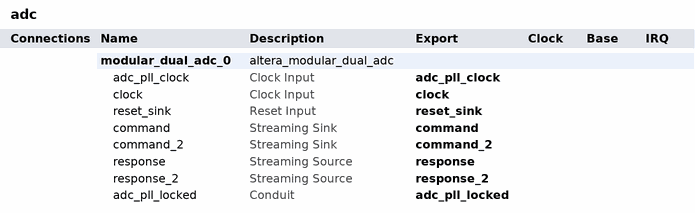
[diagram p0: system contents]
# Platform Designer (Qsys) system adc, MAX 10 10M50DAF484C7G
# Parameters at their usual value, and those the tool derives, are not listed.
package require -exact qsys 17.1
create_system adc
set_project_property DEVICE_FAMILY {MAX 10}
set_project_property DEVICE 10M50DAF484C7G

add_instance modular_dual_adc_0 altera_modular_dual_adc 17.1
set_instance_property modular_dual_adc_0 AUTO_EXPORT true
set_instance_parameter_value modular_dual_adc_0 CLOCK_FREQ 0
set_instance_parameter_value modular_dual_adc_0 CORE_VAR 3
set_instance_parameter_value modular_dual_adc_0 DEVICE_PART 10M50DAF484C7G
set_instance_parameter_value modular_dual_adc_0 ENABLE_DEBUG 0
set_instance_parameter_value modular_dual_adc_0 FAMILY {MAX 10}
set_instance_parameter_value modular_dual_adc_0 MONITOR_COUNT_WIDTH 12
set_instance_parameter_value modular_dual_adc_0 clkdiv 2
set_instance_parameter_value modular_dual_adc_0 en_thmax_ch0 false
set_instance_parameter_value modular_dual_adc_0 en_thmax_ch1 false
set_instance_parameter_value modular_dual_adc_0 en_thmax_ch10 false
set_instance_parameter_value modular_dual_adc_0 en_thmax_ch11 false
set_instance_parameter_value modular_dual_adc_0 en_thmax_ch12 false
set_instance_parameter_value modular_dual_adc_0 en_thmax_ch13 false
set_instance_parameter_value modular_dual_adc_0 en_thmax_ch14 false
set_instance_parameter_value modular_dual_adc_0 en_thmax_ch15 false
set_instance_parameter_value modular_dual_adc_0 en_thmax_ch16 false
set_instance_parameter_value modular_dual_adc_0 en_thmax_ch17 false
set_instance_parameter_value modular_dual_adc_0 en_thmax_ch2 false
set_instance_parameter_value modular_dual_adc_0 en_thmax_ch3 false
set_instance_parameter_value modular_dual_adc_0 en_thmax_ch4 false
set_instance_parameter_value modular_dual_adc_0 en_thmax_ch5 false
set_instance_parameter_value modular_dual_adc_0 en_thmax_ch6 false
set_instance_parameter_value modular_dual_adc_0 en_thmax_ch7 false
set_instance_parameter_value modular_dual_adc_0 en_thmax_ch8 false
set_instance_parameter_value modular_dual_adc_0 en_thmax_ch9 false
set_instance_parameter_value modular_dual_adc_0 en_thmin_ch0 false
set_instance_parameter_value modular_dual_adc_0 en_thmin_ch1 false
set_instance_parameter_value modular_dual_adc_0 en_thmin_ch10 false
set_instance_parameter_value modular_dual_adc_0 en_thmin_ch11 false
set_instance_parameter_value modular_dual_adc_0 en_thmin_ch12 false
set_instance_parameter_value modular_dual_adc_0 en_thmin_ch13 false
set_instance_parameter_value modular_dual_adc_0 en_thmin_ch14 false
set_instance_parameter_value modular_dual_adc_0 en_thmin_ch15 false
set_instance_parameter_value modular_dual_adc_0 en_thmin_ch16 false
set_instance_parameter_value modular_dual_adc_0 en_thmin_ch17 false
set_instance_parameter_value modular_dual_adc_0 en_thmin_ch2 false
set_instance_parameter_value modular_dual_adc_0 en_thmin_ch3 false
set_instance_parameter_value modular_dual_adc_0 en_thmin_ch4 false
set_instance_parameter_value modular_dual_adc_0 en_thmin_ch5 false
set_instance_parameter_value modular_dual_adc_0 en_thmin_ch6 false
set_instance_parameter_value modular_dual_adc_0 en_thmin_ch7 false
set_instance_parameter_value modular_dual_adc_0 en_thmin_ch8 false
set_instance_parameter_value modular_dual_adc_0 en_thmin_ch9 false
set_instance_parameter_value modular_dual_adc_0 en_tsd_max false
set_instance_parameter_value modular_dual_adc_0 en_tsd_min false
set_instance_parameter_value modular_dual_adc_0 enable_usr_sim 0
set_instance_parameter_value modular_dual_adc_0 external_vref 2.5
set_instance_parameter_value modular_dual_adc_0 external_vref_adc2 2.5
set_instance_parameter_value modular_dual_adc_0 int_vref_vr 3.0
set_instance_parameter_value modular_dual_adc_0 int_vref_vr_adc2 3.0
set_instance_parameter_value modular_dual_adc_0 prescaler_ch17 false
set_instance_parameter_value modular_dual_adc_0 prescaler_ch8 false
set_instance_parameter_value modular_dual_adc_0 refsel 0
set_instance_parameter_value modular_dual_adc_0 refsel_adc2 0
set_instance_parameter_value modular_dual_adc_0 sample_rate 0
set_instance_parameter_value modular_dual_adc_0 seq_order_length 1
set_instance_parameter_value modular_dual_adc_0 seq_order_slot_1 30
set_instance_parameter_value modular_dual_adc_0 seq_order_slot_10 30
set_instance_parameter_value modular_dual_adc_0 seq_order_slot_10_adc2 30
set_instance_parameter_value modular_dual_adc_0 seq_order_slot_11 30
set_instance_parameter_value modular_dual_adc_0 seq_order_slot_11_adc2 30
set_instance_parameter_value modular_dual_adc_0 seq_order_slot_12 30
set_instance_parameter_value modular_dual_adc_0 seq_order_slot_12_adc2 30
set_instance_parameter_value modular_dual_adc_0 seq_order_slot_13 30
set_instance_parameter_value modular_dual_adc_0 seq_order_slot_13_adc2 30
set_instance_parameter_value modular_dual_adc_0 seq_order_slot_14 30
set_instance_parameter_value modular_dual_adc_0 seq_order_slot_14_adc2 30
set_instance_parameter_value modular_dual_adc_0 seq_order_slot_15 30
set_instance_parameter_value modular_dual_adc_0 seq_order_slot_15_adc2 30
set_instance_parameter_value modular_dual_adc_0 seq_order_slot_16 30
set_instance_parameter_value modular_dual_adc_0 seq_order_slot_16_adc2 30
set_instance_parameter_value modular_dual_adc_0 seq_order_slot_17 30
set_instance_parameter_value modular_dual_adc_0 seq_order_slot_17_adc2 30
set_instance_parameter_value modular_dual_adc_0 seq_order_slot_18 30
set_instance_parameter_value modular_dual_adc_0 seq_order_slot_18_adc2 30
set_instance_parameter_value modular_dual_adc_0 seq_order_slot_19 30
set_instance_parameter_value modular_dual_adc_0 seq_order_slot_19_adc2 30
set_instance_parameter_value modular_dual_adc_0 seq_order_slot_1_adc2 30
set_instance_parameter_value modular_dual_adc_0 seq_order_slot_2 30
set_instance_parameter_value modular_dual_adc_0 seq_order_slot_20 30
set_instance_parameter_value modular_dual_adc_0 seq_order_slot_20_adc2 30
set_instance_parameter_value modular_dual_adc_0 seq_order_slot_21 30
set_instance_parameter_value modular_dual_adc_0 seq_order_slot_21_adc2 30
set_instance_parameter_value modular_dual_adc_0 seq_order_slot_22 30
set_instance_parameter_value modular_dual_adc_0 seq_order_slot_22_adc2 30
set_instance_parameter_value modular_dual_adc_0 seq_order_slot_23 30
set_instance_parameter_value modular_dual_adc_0 seq_order_slot_23_adc2 30
set_instance_parameter_value modular_dual_adc_0 seq_order_slot_24 30
set_instance_parameter_value modular_dual_adc_0 seq_order_slot_24_adc2 30
set_instance_parameter_value modular_dual_adc_0 seq_order_slot_25 30
set_instance_parameter_value modular_dual_adc_0 seq_order_slot_25_adc2 30
set_instance_parameter_value modular_dual_adc_0 seq_order_slot_26 30
set_instance_parameter_value modular_dual_adc_0 seq_order_slot_26_adc2 30
set_instance_parameter_value modular_dual_adc_0 seq_order_slot_27 30
set_instance_parameter_value modular_dual_adc_0 seq_order_slot_27_adc2 30
set_instance_parameter_value modular_dual_adc_0 seq_order_slot_28 30
set_instance_parameter_value modular_dual_adc_0 seq_order_slot_28_adc2 30
set_instance_parameter_value modular_dual_adc_0 seq_order_slot_29 30
set_instance_parameter_value modular_dual_adc_0 seq_order_slot_29_adc2 30
set_instance_parameter_value modular_dual_adc_0 seq_order_slot_2_adc2 30
set_instance_parameter_value modular_dual_adc_0 seq_order_slot_3 30
set_instance_parameter_value modular_dual_adc_0 seq_order_slot_30 30
set_instance_parameter_value modular_dual_adc_0 seq_order_slot_30_adc2 30
set_instance_parameter_value modular_dual_adc_0 seq_order_slot_31 30
set_instance_parameter_value modular_dual_adc_0 seq_order_slot_31_adc2 30
set_instance_parameter_value modular_dual_adc_0 seq_order_slot_32 30
set_instance_parameter_value modular_dual_adc_0 seq_order_slot_32_adc2 30
set_instance_parameter_value modular_dual_adc_0 seq_order_slot_33 30
set_instance_parameter_value modular_dual_adc_0 seq_order_slot_33_adc2 30
set_instance_parameter_value modular_dual_adc_0 seq_order_slot_34 30
set_instance_parameter_value modular_dual_adc_0 seq_order_slot_34_adc2 30
set_instance_parameter_value modular_dual_adc_0 seq_order_slot_35 30
set_instance_parameter_value modular_dual_adc_0 seq_order_slot_35_adc2 30
set_instance_parameter_value modular_dual_adc_0 seq_order_slot_36 30
set_instance_parameter_value modular_dual_adc_0 seq_order_slot_36_adc2 30
set_instance_parameter_value modular_dual_adc_0 seq_order_slot_37 30
set_instance_parameter_value modular_dual_adc_0 seq_order_slot_37_adc2 30
set_instance_parameter_value modular_dual_adc_0 seq_order_slot_38 30
set_instance_parameter_value modular_dual_adc_0 seq_order_slot_38_adc2 30
set_instance_parameter_value modular_dual_adc_0 seq_order_slot_39 30
set_instance_parameter_value modular_dual_adc_0 seq_order_slot_39_adc2 30
set_instance_parameter_value modular_dual_adc_0 seq_order_slot_3_adc2 30
set_instance_parameter_value modular_dual_adc_0 seq_order_slot_4 30
set_instance_parameter_value modular_dual_adc_0 seq_order_slot_40 30
set_instance_parameter_value modular_dual_adc_0 seq_order_slot_40_adc2 30
set_instance_parameter_value modular_dual_adc_0 seq_order_slot_41 30
set_instance_parameter_value modular_dual_adc_0 seq_order_slot_41_adc2 30
set_instance_parameter_value modular_dual_adc_0 seq_order_slot_42 30
set_instance_parameter_value modular_dual_adc_0 seq_order_slot_42_adc2 30
set_instance_parameter_value modular_dual_adc_0 seq_order_slot_43 30
set_instance_parameter_value modular_dual_adc_0 seq_order_slot_43_adc2 30
set_instance_parameter_value modular_dual_adc_0 seq_order_slot_44 30
set_instance_parameter_value modular_dual_adc_0 seq_order_slot_44_adc2 30
set_instance_parameter_value modular_dual_adc_0 seq_order_slot_45 30
set_instance_parameter_value modular_dual_adc_0 seq_order_slot_45_adc2 30
set_instance_parameter_value modular_dual_adc_0 seq_order_slot_46 30
set_instance_parameter_value modular_dual_adc_0 seq_order_slot_46_adc2 30
set_instance_parameter_value modular_dual_adc_0 seq_order_slot_47 30
set_instance_parameter_value modular_dual_adc_0 seq_order_slot_47_adc2 30
set_instance_parameter_value modular_dual_adc_0 seq_order_slot_48 30
set_instance_parameter_value modular_dual_adc_0 seq_order_slot_48_adc2 30
set_instance_parameter_value modular_dual_adc_0 seq_order_slot_49 30
set_instance_parameter_value modular_dual_adc_0 seq_order_slot_49_adc2 30
set_instance_parameter_value modular_dual_adc_0 seq_order_slot_4_adc2 30
set_instance_parameter_value modular_dual_adc_0 seq_order_slot_5 30
set_instance_parameter_value modular_dual_adc_0 seq_order_slot_50 30
set_instance_parameter_value modular_dual_adc_0 seq_order_slot_50_adc2 30
set_instance_parameter_value modular_dual_adc_0 seq_order_slot_51 30
set_instance_parameter_value modular_dual_adc_0 seq_order_slot_51_adc2 30
set_instance_parameter_value modular_dual_adc_0 seq_order_slot_52 30
set_instance_parameter_value modular_dual_adc_0 seq_order_slot_52_adc2 30
set_instance_parameter_value modular_dual_adc_0 seq_order_slot_53 30
set_instance_parameter_value modular_dual_adc_0 seq_order_slot_53_adc2 30
set_instance_parameter_value modular_dual_adc_0 seq_order_slot_54 30
set_instance_parameter_value modular_dual_adc_0 seq_order_slot_54_adc2 30
set_instance_parameter_value modular_dual_adc_0 seq_order_slot_55 30
set_instance_parameter_value modular_dual_adc_0 seq_order_slot_55_adc2 30
set_instance_parameter_value modular_dual_adc_0 seq_order_slot_56 30
set_instance_parameter_value modular_dual_adc_0 seq_order_slot_56_adc2 30
set_instance_parameter_value modular_dual_adc_0 seq_order_slot_57 30
set_instance_parameter_value modular_dual_adc_0 seq_order_slot_57_adc2 30
set_instance_parameter_value modular_dual_adc_0 seq_order_slot_58 30
set_instance_parameter_value modular_dual_adc_0 seq_order_slot_58_adc2 30
set_instance_parameter_value modular_dual_adc_0 seq_order_slot_59 30
set_instance_parameter_value modular_dual_adc_0 seq_order_slot_59_adc2 30
set_instance_parameter_value modular_dual_adc_0 seq_order_slot_5_adc2 30
set_instance_parameter_value modular_dual_adc_0 seq_order_slot_6 30
set_instance_parameter_value modular_dual_adc_0 seq_order_slot_60 30
set_instance_parameter_value modular_dual_adc_0 seq_order_slot_60_adc2 30
set_instance_parameter_value modular_dual_adc_0 seq_order_slot_61 30
set_instance_parameter_value modular_dual_adc_0 seq_order_slot_61_adc2 30
set_instance_parameter_value modular_dual_adc_0 seq_order_slot_62 30
set_instance_parameter_value modular_dual_adc_0 seq_order_slot_62_adc2 30
set_instance_parameter_value modular_dual_adc_0 seq_order_slot_63 30
set_instance_parameter_value modular_dual_adc_0 seq_order_slot_63_adc2 30
set_instance_parameter_value modular_dual_adc_0 seq_order_slot_64 30
set_instance_parameter_value modular_dual_adc_0 seq_order_slot_64_adc2 30
set_instance_parameter_value modular_dual_adc_0 seq_order_slot_6_adc2 30
set_instance_parameter_value modular_dual_adc_0 seq_order_slot_7 30
set_instance_parameter_value modular_dual_adc_0 seq_order_slot_7_adc2 30
set_instance_parameter_value modular_dual_adc_0 seq_order_slot_8 30
set_instance_parameter_value modular_dual_adc_0 seq_order_slot_8_adc2 30
set_instance_parameter_value modular_dual_adc_0 seq_order_slot_9 30
set_instance_parameter_value modular_dual_adc_0 seq_order_slot_9_adc2 30
set_instance_parameter_value modular_dual_adc_0 thmax_ch0 0.0
set_instance_parameter_value modular_dual_adc_0 thmax_ch1 0.0
set_instance_parameter_value modular_dual_adc_0 thmax_ch10 0.0
set_instance_parameter_value modular_dual_adc_0 thmax_ch11 0.0
set_instance_parameter_value modular_dual_adc_0 thmax_ch12 0.0
set_instance_parameter_value modular_dual_adc_0 thmax_ch13 0.0
set_instance_parameter_value modular_dual_adc_0 thmax_ch14 0.0
set_instance_parameter_value modular_dual_adc_0 thmax_ch15 0.0
set_instance_parameter_value modular_dual_adc_0 thmax_ch16 0.0
set_instance_parameter_value modular_dual_adc_0 thmax_ch17 0.0
set_instance_parameter_value modular_dual_adc_0 thmax_ch2 0.0
set_instance_parameter_value modular_dual_adc_0 thmax_ch3 0.0
set_instance_parameter_value modular_dual_adc_0 thmax_ch4 0.0
set_instance_parameter_value modular_dual_adc_0 thmax_ch5 0.0
set_instance_parameter_value modular_dual_adc_0 thmax_ch6 0.0
set_instance_parameter_value modular_dual_adc_0 thmax_ch7 0.0
set_instance_parameter_value modular_dual_adc_0 thmax_ch8 0.0
set_instance_parameter_value modular_dual_adc_0 thmax_ch9 0.0
set_instance_parameter_value modular_dual_adc_0 thmin_ch0 0.0
set_instance_parameter_value modular_dual_adc_0 thmin_ch1 0.0
set_instance_parameter_value modular_dual_adc_0 thmin_ch10 0.0
set_instance_parameter_value modular_dual_adc_0 thmin_ch11 0.0
set_instance_parameter_value modular_dual_adc_0 thmin_ch12 0.0
set_instance_parameter_value modular_dual_adc_0 thmin_ch13 0.0
set_instance_parameter_value modular_dual_adc_0 thmin_ch14 0.0
set_instance_parameter_value modular_dual_adc_0 thmin_ch15 0.0
set_instance_parameter_value modular_dual_adc_0 thmin_ch16 0.0
set_instance_parameter_value modular_dual_adc_0 thmin_ch17 0.0
set_instance_parameter_value modular_dual_adc_0 thmin_ch2 0.0
set_instance_parameter_value modular_dual_adc_0 thmin_ch3 0.0
set_instance_parameter_value modular_dual_adc_0 thmin_ch4 0.0
set_instance_parameter_value modular_dual_adc_0 thmin_ch5 0.0
set_instance_parameter_value modular_dual_adc_0 thmin_ch6 0.0
set_instance_parameter_value modular_dual_adc_0 thmin_ch7 0.0
set_instance_parameter_value modular_dual_adc_0 thmin_ch8 0.0
set_instance_parameter_value modular_dual_adc_0 thmin_ch9 0.0
set_instance_parameter_value modular_dual_adc_0 tsclksel 1
set_instance_parameter_value modular_dual_adc_0 tsd_max 125
set_instance_parameter_value modular_dual_adc_0 tsd_min 0
set_instance_parameter_value modular_dual_adc_0 use_ch0 true
set_instance_parameter_value modular_dual_adc_0 use_ch1 true
set_instance_parameter_value modular_dual_adc_0 use_ch10 false
set_instance_parameter_value modular_dual_adc_0 use_ch11 false
set_instance_parameter_value modular_dual_adc_0 use_ch12 false
set_instance_parameter_value modular_dual_adc_0 use_ch13 false
set_instance_parameter_value modular_dual_adc_0 use_ch14 false
set_instance_parameter_value modular_dual_adc_0 use_ch15 false
set_instance_parameter_value modular_dual_adc_0 use_ch16 false
set_instance_parameter_value modular_dual_adc_0 use_ch17 false
set_instance_parameter_value modular_dual_adc_0 use_ch2 true
set_instance_parameter_value modular_dual_adc_0 use_ch3 false
set_instance_parameter_value modular_dual_adc_0 use_ch4 false
set_instance_parameter_value modular_dual_adc_0 use_ch5 false
set_instance_parameter_value modular_dual_adc_0 use_ch6 false
set_instance_parameter_value modular_dual_adc_0 use_ch7 false
set_instance_parameter_value modular_dual_adc_0 use_ch8 false
set_instance_parameter_value modular_dual_adc_0 use_ch9 false
set_instance_parameter_value modular_dual_adc_0 use_tsd false

# exported interfaces
add_interface adc_pll_clock clock sink
set_interface_property adc_pll_clock EXPORT_OF modular_dual_adc_0.adc_pll_clock
add_interface adc_pll_locked conduit end
set_interface_property adc_pll_locked EXPORT_OF modular_dual_adc_0.adc_pll_locked
add_interface clock clock sink
set_interface_property clock EXPORT_OF modular_dual_adc_0.clock
add_interface command avalon_streaming sink
set_interface_property command EXPORT_OF modular_dual_adc_0.command
add_interface command_2 avalon_streaming sink
set_interface_property command_2 EXPORT_OF modular_dual_adc_0.command_2
add_interface reset_sink reset sink
set_interface_property reset_sink EXPORT_OF modular_dual_adc_0.reset_sink
add_interface response avalon_streaming source
set_interface_property response EXPORT_OF modular_dual_adc_0.response
add_interface response_2 avalon_streaming source
set_interface_property response_2 EXPORT_OF modular_dual_adc_0.response_2

set_interconnect_requirement {$system} qsys_mm.clockCrossingAdapter HANDSHAKE
set_interconnect_requirement {$system} qsys_mm.enableEccProtection FALSE
set_interconnect_requirement {$system} qsys_mm.insertDefaultSlave FALSE
set_interconnect_requirement {$system} qsys_mm.maxAdditionalLatency 1

save_system adc.qsys
